# EAGLE design PCB-DDEX-BASE (EAGLE 9.6.1)
COMPANY_HQ: BUFFALO, NY; COMPANY_NAME: KAISERENGINEERING LLC; PROJECT: DIGITAL DASH EXPANSION CARD; SCH_REV: A
Assembly variants: Production
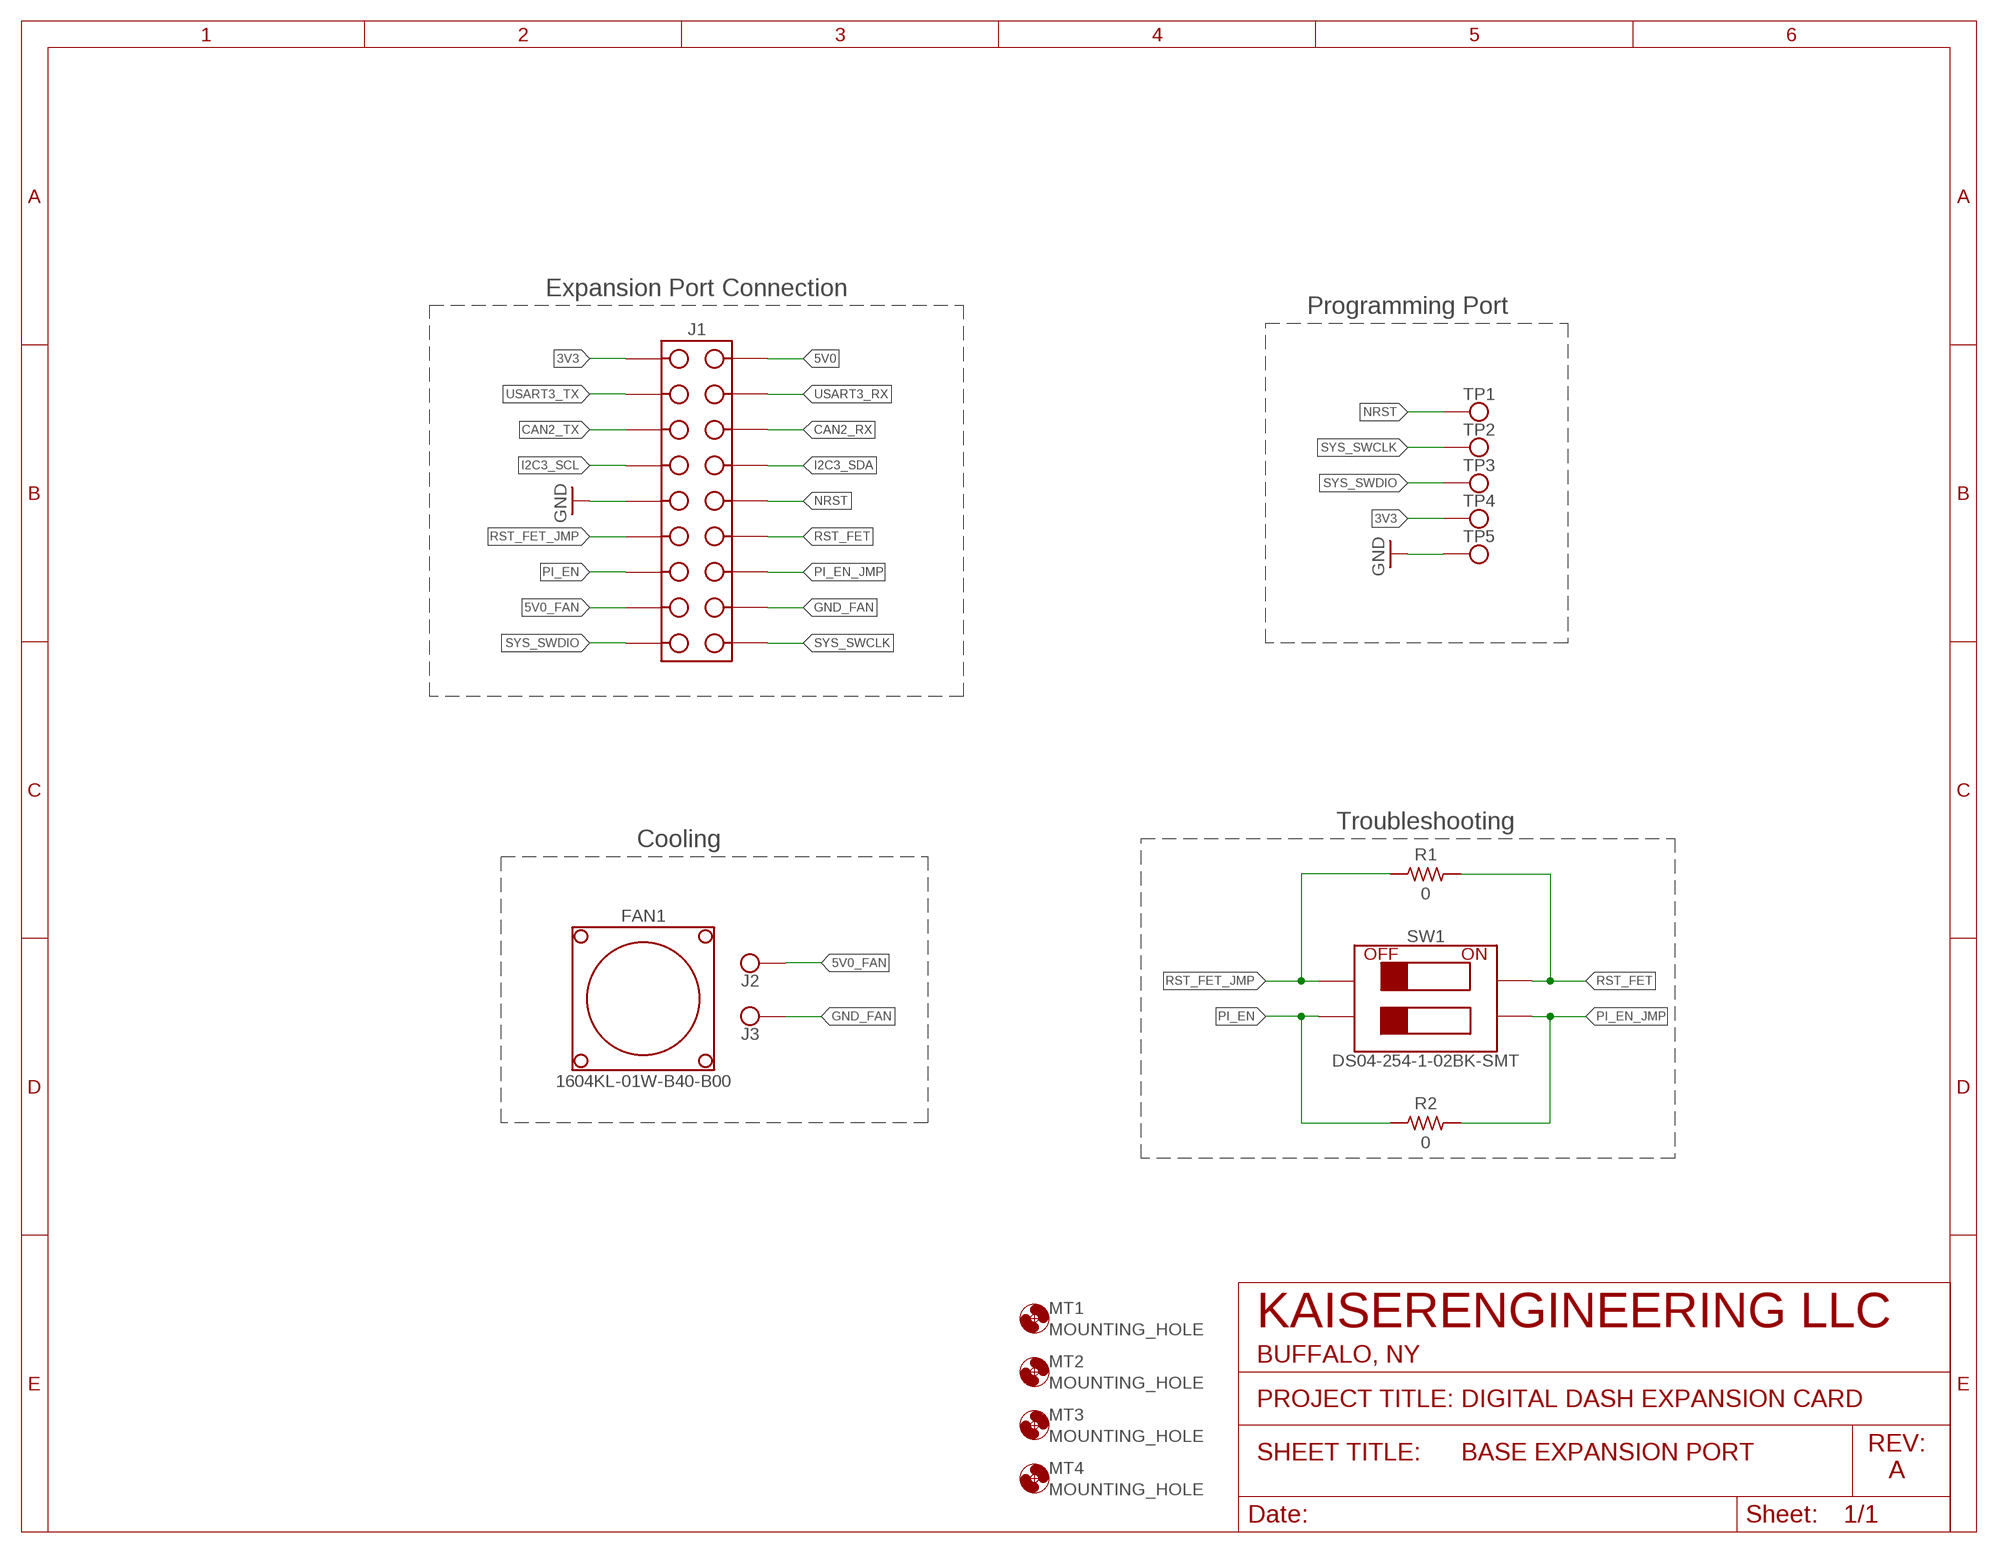
[diagram p0: schematic, sheet 1]

## Parts
FAN1  NMB_1604KL-01W-B40-B00  [NMB_40MMX40MMX10MM_FAN]
J1  HEADER_9X2PIN_VERT  [HEADER_100MIL_9X2]
J2  SOLDER_POINT  [SMD_PAD_100X200]
J3  SOLDER_POINT  [SMD_PAD_100X200]
MT1  MOUNTING_HOLE  [MT_2MM]
MT2  MOUNTING_HOLE  [MT_2MM]
MT3  MOUNTING_HOLE  [MT_2MM]
MT4  MOUNTING_HOLE  [MT_2MM]
R1  0  0OHM-0603-1%-1/10W  [REST-0603]  (not fitted in variant Production)
R2  0  0OHM-0603-1%-1/10W  [REST-0603]  (not fitted in variant Production)
SW1  DIP2_CUI_DS04-254-1-02BK-SMT  [DIP2_SMD_254]
TP1  SOLDER_POINT_ROUND  [SMD_PAD_ROUND]
TP2  SOLDER_POINT_ROUND  [SMD_PAD_ROUND]
TP3  SOLDER_POINT_ROUND  [SMD_PAD_ROUND]
TP4  SOLDER_POINT_ROUND  [SMD_PAD_ROUND]
TP5  SOLDER_POINT_ROUND  [SMD_PAD_ROUND]

## Nets
3V3: J1.P$10 TP4.1(IN)
5V0: J1.P$1
5V0_FAN: J1.P$17 J2.1(IN)
CAN2_RX: J1.P$3
CAN2_TX: J1.P$12
GND: J1.P$14 TP5.1(IN)
GND_FAN: J1.P$8 J3.1(IN)
I2C3_SCL: J1.P$13
I2C3_SDA: J1.P$4
NRST: J1.P$5 TP1.1(IN)
PI_EN: J1.P$16 R2.1 SW1.3
PI_EN_JMP: J1.P$7 R2.2 SW1.4
RST_FET: J1.P$6 R1.2 SW1.2
RST_FET_JMP: J1.P$15 R1.1 SW1.1
SYS_SWCLK: J1.P$9 TP2.1(IN)
SYS_SWDIO: J1.P$18 TP3.1(IN)
USART3_RX: J1.P$2
USART3_TX: J1.P$11

## Notes on the sheet
- Expansion Port Connection
- Programming Port
- Troubleshooting
- Cooling

## Library data of the parts
FAN1 = AlphaLibrary:NMB_1604KL-01W-B40-B00: DC Fan Axial Ball Bearing 5V 4.5V to 5.5V 5.3CFM 25dB 40 X 40 X 10mm; MFG: NMB; MNT: N/A; PINS: 0; PKG: 40X40X10; PN: 1604KL-01W-B40-B00
J1 = AlphaLibrary:HEADER_9X2PIN_VERT: 2.54mm Socket Header, SMD, Straight; MFG: WURTH; MNT: SMD; PINS: 18; PKG: SMD_0.1PITCH; PN: 61031821821
J2 J3 = AlphaLibrary:SOLDER_POINT
MT1-MT4 = AlphaLibrary:MOUNTING_HOLE; MFG: NA; PN: NA
R1 R2 = resistors:0OHM: RES, 0603, 0 OHM, 1%, 1/10W; MFG: VISHAY; MNT: SMD; PINS: 2; PKG: 0603; PN: CRCW06030000Z0EA
SW1 = AlphaLibrary:DIP2_CUI_DS04-254-1-02BK-SMT: DIP Switch, 2 Pole, SMD; MFG: CUI; MNT: SMD; PINS: 4; PKG: 2.54MM; PN: DS04-254-1-02BK-SMT
TP1-TP5 = AlphaLibrary:SOLDER_POINT_ROUND

## Board
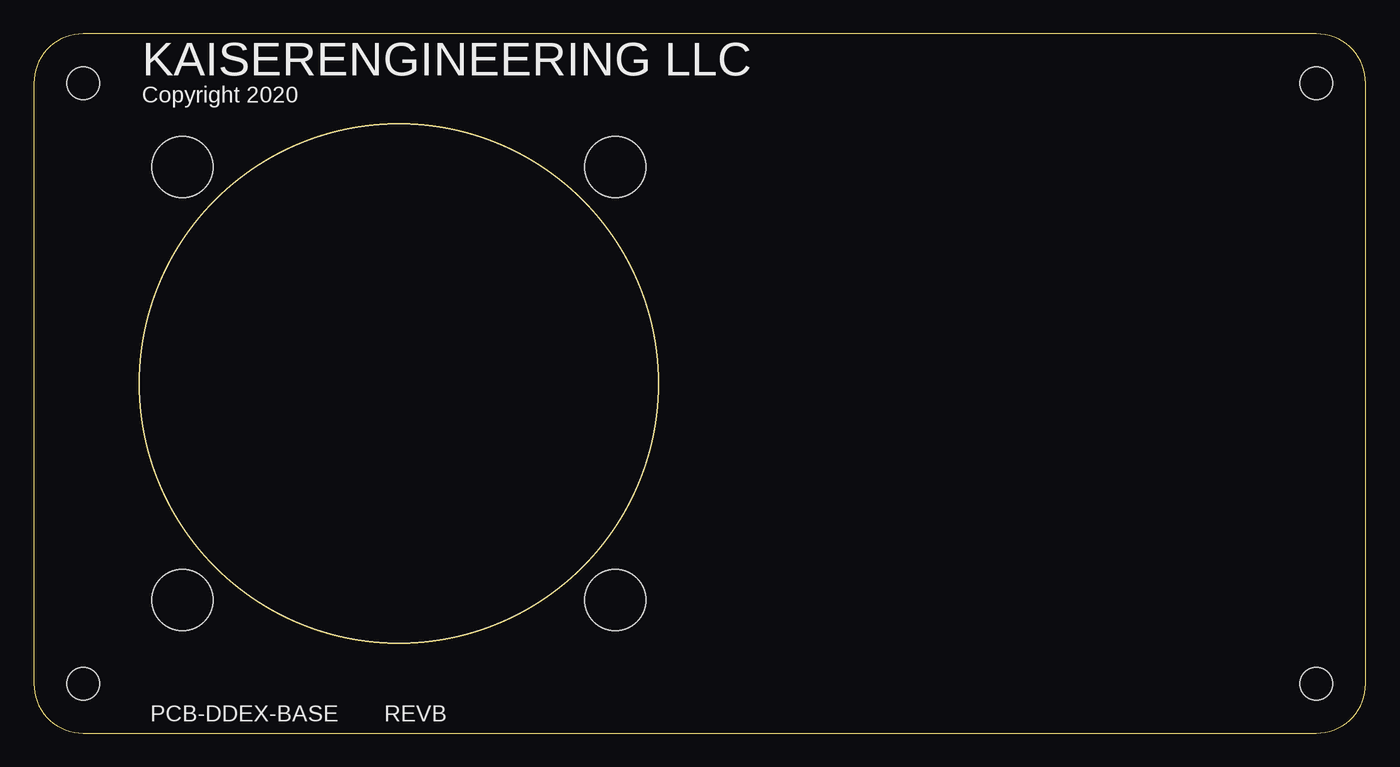
[diagram p1: board, top side]
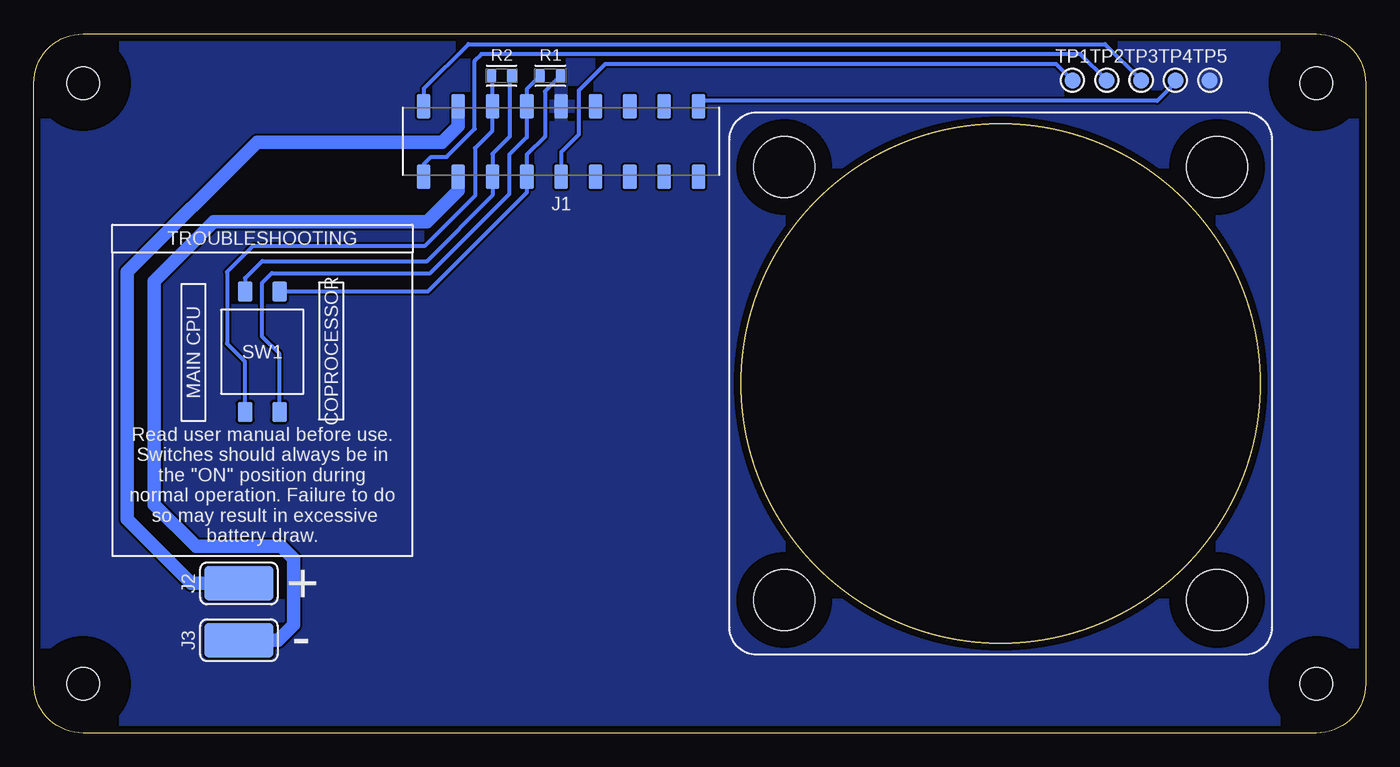
[diagram p2: board, bottom side, seen from below]

Size 98.5 x 51.7 mm. Coordinates in mm from the lower left corner, seen from the top.
Outline: 0,48.05 0,3.65 arc90 3.65,0 94.85,0 arc90 98.5,3.65 98.5,48.05 arc90 94.85,51.7 3.65,51.7 arc90 0,48.05
Copper layers (1*16): Top 0.035mm / dielectric 1.5mm / Bottom 0.035mm
Design rules "default *": minimum track width 6mil, minimum drill 0.35mm, track to track 6mil, track to pad 6mil, pad to pad 6mil, via to via 6mil, smd to smd 6mil, copper to edge 20mil, drill to drill 6mil, minimum pad ring 10mil, minimum via ring 8mil, stop-mask expansion 4mil, vias tented up to drill 0mil, thermal gap 10mil

### Footprints (pad centres in the part's own frame; a part is rotated, then mirrored left to right if it is on the bottom)
NMB_40MMX40MMX10MM_FAN = hole 4.5: -16,16; 16,16; 16,-16; -16,-16 | hole 38.4: 0,0
HEADER_100MIL_9X2 = smd 1 x 1.8: P$1 -10.16,2.6; P$2 -7.62,2.6; P$3 -5.08,2.6; P$4 -2.54,2.6; P$5 0,2.6; P$6 2.54,2.6; P$7 5.08,2.6; P$8 7.62,2.6; P$9 10.16,2.6; P$10 -10.16,-2.6; P$11 -7.62,-2.6; P$12 -5.08,-2.6; P$13 -2.54,-2.6; P$14 0,-2.6; P$15 2.54,-2.6; P$16 5.08,-2.6; P$17 7.62,-2.6; P$18 10.16,-2.6
SMD_PAD_100X200 = smd 2.55 x 5.1: 1 0,0
MT_2MM = hole 2.4: 0,0
REST-0603 = smd 0.7 x 0.9: 1 -0.75,0; 2 0.75,0
DIP2_SMD_254 = smd 1.1 x 1.5: 1 -1.27,4.45; 2 -1.27,-4.45; 3 1.27,4.45; 4 1.27,-4.45
SMD_PAD_ROUND = smd 1.2 x 1.2: 1 0,0

### Placement (x,y rotation side)
FAN1  27,25.85 0 bottom
J1  59.5,43.75 180 bottom
J2  83.33,11.07 90 bottom
J3  83.33,6.87 90 bottom
MT1  3.65,48.05 0 top
MT2  3.65,3.65 0 top
MT3  94.85,3.65 0 top
MT4  94.85,48.05 0 top
R1  60.3,48.6 0 bottom  (not fitted)
R2  63.9,48.6 0 bottom  (not fitted)
SW1  81.6,28.2 180 bottom
TP1  21.69,48.26 90 bottom
TP2  19.15,48.26 90 bottom
TP3  16.61,48.26 90 bottom
TP4  14.07,48.26 90 bottom
TP5  11.53,48.26 90 bottom

### Tracks (layer width: path | path; a pad name or v marks a point on that pad's centre or on a via)
3V3
  Bottom 0.3: J1.P$10 48.94,46.75 15.42,46.75 14.07,48.1 TP4.1
5V0_FAN
  Bottom 1: J1.P$17 67.12,44.88 68.3,43.7 82,43.7 91.6,34.1 91.6,15.8 86.87,11.07 J2.1
GND
  pour Bottom: -1.8,55.3 -1.8,-1.5 103.3,-1.5 103.3,55.3
GND_FAN
  Bottom 1: J1.P$8 67.12,40.08 69.4,37.8 85.2,37.8 89.6,33.4 89.6,16.9 86.5,13.8 80.2,13.8 79.3,12.9 79.3,8 80.43,6.87 J3.1
NRST
  Bottom 0.3: J1.P$5 59.5,42.95 58.2,44.25 58.2,47.5 56.24,49.46 22.89,49.46 TP1.1
PI_EN
  Bottom 0.3: R2.1 64.58,48.53 J1.P$16 64.58,44.55 65.88,43.25 65.88,39.72 69.6,36 82.3,36 84.2,34.1 84.2,28.8 82.87,27.47 SW1.3
PI_EN_JMP
  Bottom 0.3: SW1.4 82.87,33.63 81.6,34.9 69.43,34.9 64.58,39.75 J1.P$7 64.58,42.82 63.3,44.1 63.3,48.45 R2.2
RST_FET
  Bottom 0.3: SW1.2 69.35,32.65 62.04,39.96 J1.P$6 62.04,42.76 60.7,44.1 60.7,47.45 R1.2
RST_FET_JMP
  Bottom 0.3: R1.1 62.04,47.61 J1.P$15 62.04,44.05 63.34,42.75 63.34,39.85 69.19,34 80.9,34 81.6,33.3 81.6,29.3 80.33,28.03 SW1.1
SYS_SWCLK
  Bottom 0.3: J1.P$9 69.66,42.04 69.1,42.6 67.97,42.6 65.9,44.66 65.9,49.7 65.4,50.2 21.09,50.2 TP2.1
SYS_SWDIO
  Bottom 0.3: J1.P$18 69.66,47.64 66.36,50.94 19.29,50.94 TP3.1

### Text on the board
tPlace: KAISERENGINEERING LLC | Copyright 2020 | PCB-DDEX-BASE REVB
bPlace: TROUBLESHOOTING | COPROCESSOR | MAIN CPU | Read user manual before use. / Switches should always be in / the "ON" position during / normal operation. Failure to do / so may result in excessive / battery draw. | + | -